# Altium schematic sheet sensor.SchDoc
size A3
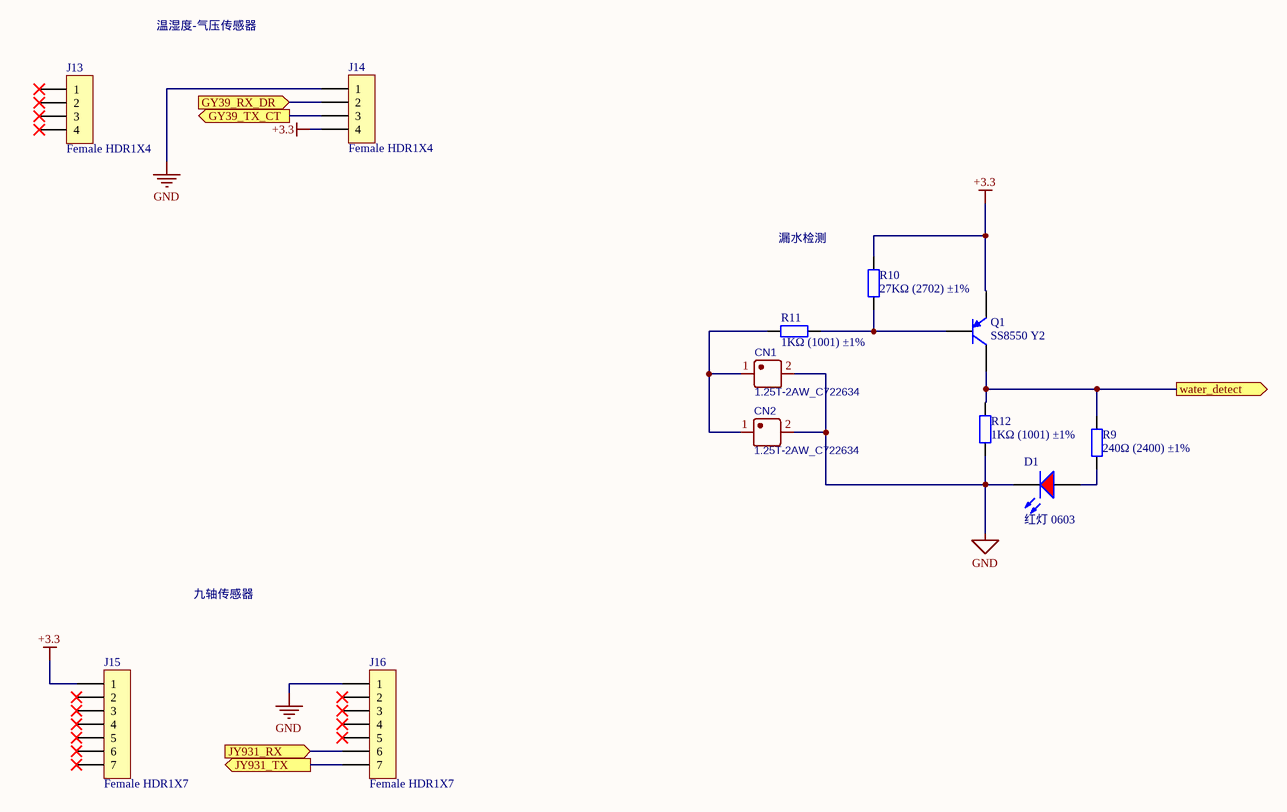
[diagram p0: sensor.SchDoc]

## Parts
CN1  1.25T-2AW_C722634  [GH-1.25]
CN2  1.25T-2AW_C722634  [GH-1.25]
D1  红灯 0603  [0603_LED_S1]
J13  Female HDR1X4  [Fe-HDR1X4/2.54-S]
J14  Female HDR1X4  [Fe-HDR1X4/2.54-S]
J15  Female HDR1X7  [Fe-HDR1X7/2.54-S]
J16  Female HDR1X7  [Fe-HDR1X7/2.54-S]
Q1  SS8550 Y2  [SOT-23(SOT-23-3)]
R9  240Ω (2400) ±1%  [0603_R]
R10  27KΩ (2702) ±1%  [0603_R]
R11  1KΩ (1001) ±1%  [0603_R]
R12  1KΩ (1001) ±1%  [0603_R]

## Ports
GY39_RX_DR (in), GY39_TX_CT (out), JY931_RX (in), JY931_TX (out), water_detect (out)

## Nets
+3.3: J14.4 J15.1 Q1.2(E) R10.2
GND: CN1.2 CN2.2 D1.K J14.1 J16.1 R12.1
GY39_RX_DR: J14.2 ; port GY39_RX_DR
GY39_TX_CT: J14.3 ; port GY39_TX_CT
JY931_RX: J16.6 ; port JY931_RX
JY931_TX: J16.7 ; port JY931_TX
water_detect: Q1.3(C) R9.2 R12.2 ; port water_detect
NetCN1_1: CN1.1 CN2.1 R11.1
NetD1_A: D1.A R9.1
NetQ1_1: Q1.1(B) R10.1 R11.2

Not connected (* = marked no-connect by the designer): J13 1* 2* 3* 4*; J15 2* 3* 4* 5* 6* 7*; J16 2* 3* 4* 5*

## Notes on the sheet
- 温湿度-气压传感器
- 漏水检测
- 九轴传感器

## Library data of the parts
CN1 CN2 = GH 1.25T-2AW_C722634: BOM_Manufacturer: CAX; Contributor: LCSC; BOM_Paste Type: expand; BOM_Supplier: LCSC; BOM_Supplier Part: C722634; BOM_Manufacturer Part: 1.25T-2AW; spicePre: C; spiceSymbolName: 1.25T-2AW_C722634
D1 = 0603 红灯: 发光二极管; ComponentLink1Description: 供应商链接; ComponentLink1URL: http://www.szlcsc.com/product/details_2659.html; Package: 0603; Supplier: LC; SuppliersPartNumber: C2286
Q1 = SOT-23 SS8550 Y2: 三极管; ComponentLink1Description: 供应商链接; ComponentLink1URL: http://www.szlcsc.com/product/details_9037.html; Package: SOT-23; Supplier: LC; SuppliersPartNumber: C8542
R9 = 0603 240Ω (2400) 1%: 贴片电阻; ComponentLink1Description: 供应商链接; ComponentLink1URL: http://www.szlcsc.com/product/details_24083.html; Package: 0603; Supplier: LC; SuppliersPartNumber: C23350
R10 = 0603 27KΩ (2702) 1%: 贴片电阻; ComponentLink1Description: 供应商链接; ComponentLink1URL: http://www.szlcsc.com/product/details_23694.html; Package: 0603; Supplier: LC; SuppliersPartNumber: C22967
R11 R12 = 0603 1KΩ (1001) 1%: 贴片电阻; ComponentLink1Description: 供应商链接; ComponentLink1URL: http://www.szlcsc.com/product/details_21904.html; Package: 0603; Supplier: LC; SuppliersPartNumber: C21190